# EAGLE design bioamplifier-00 (EAGLE 7.7.0)
CNAME: BIO-AMPLIFIER - BA01; CREVISION: B; DESIGNER: PEYRILLER
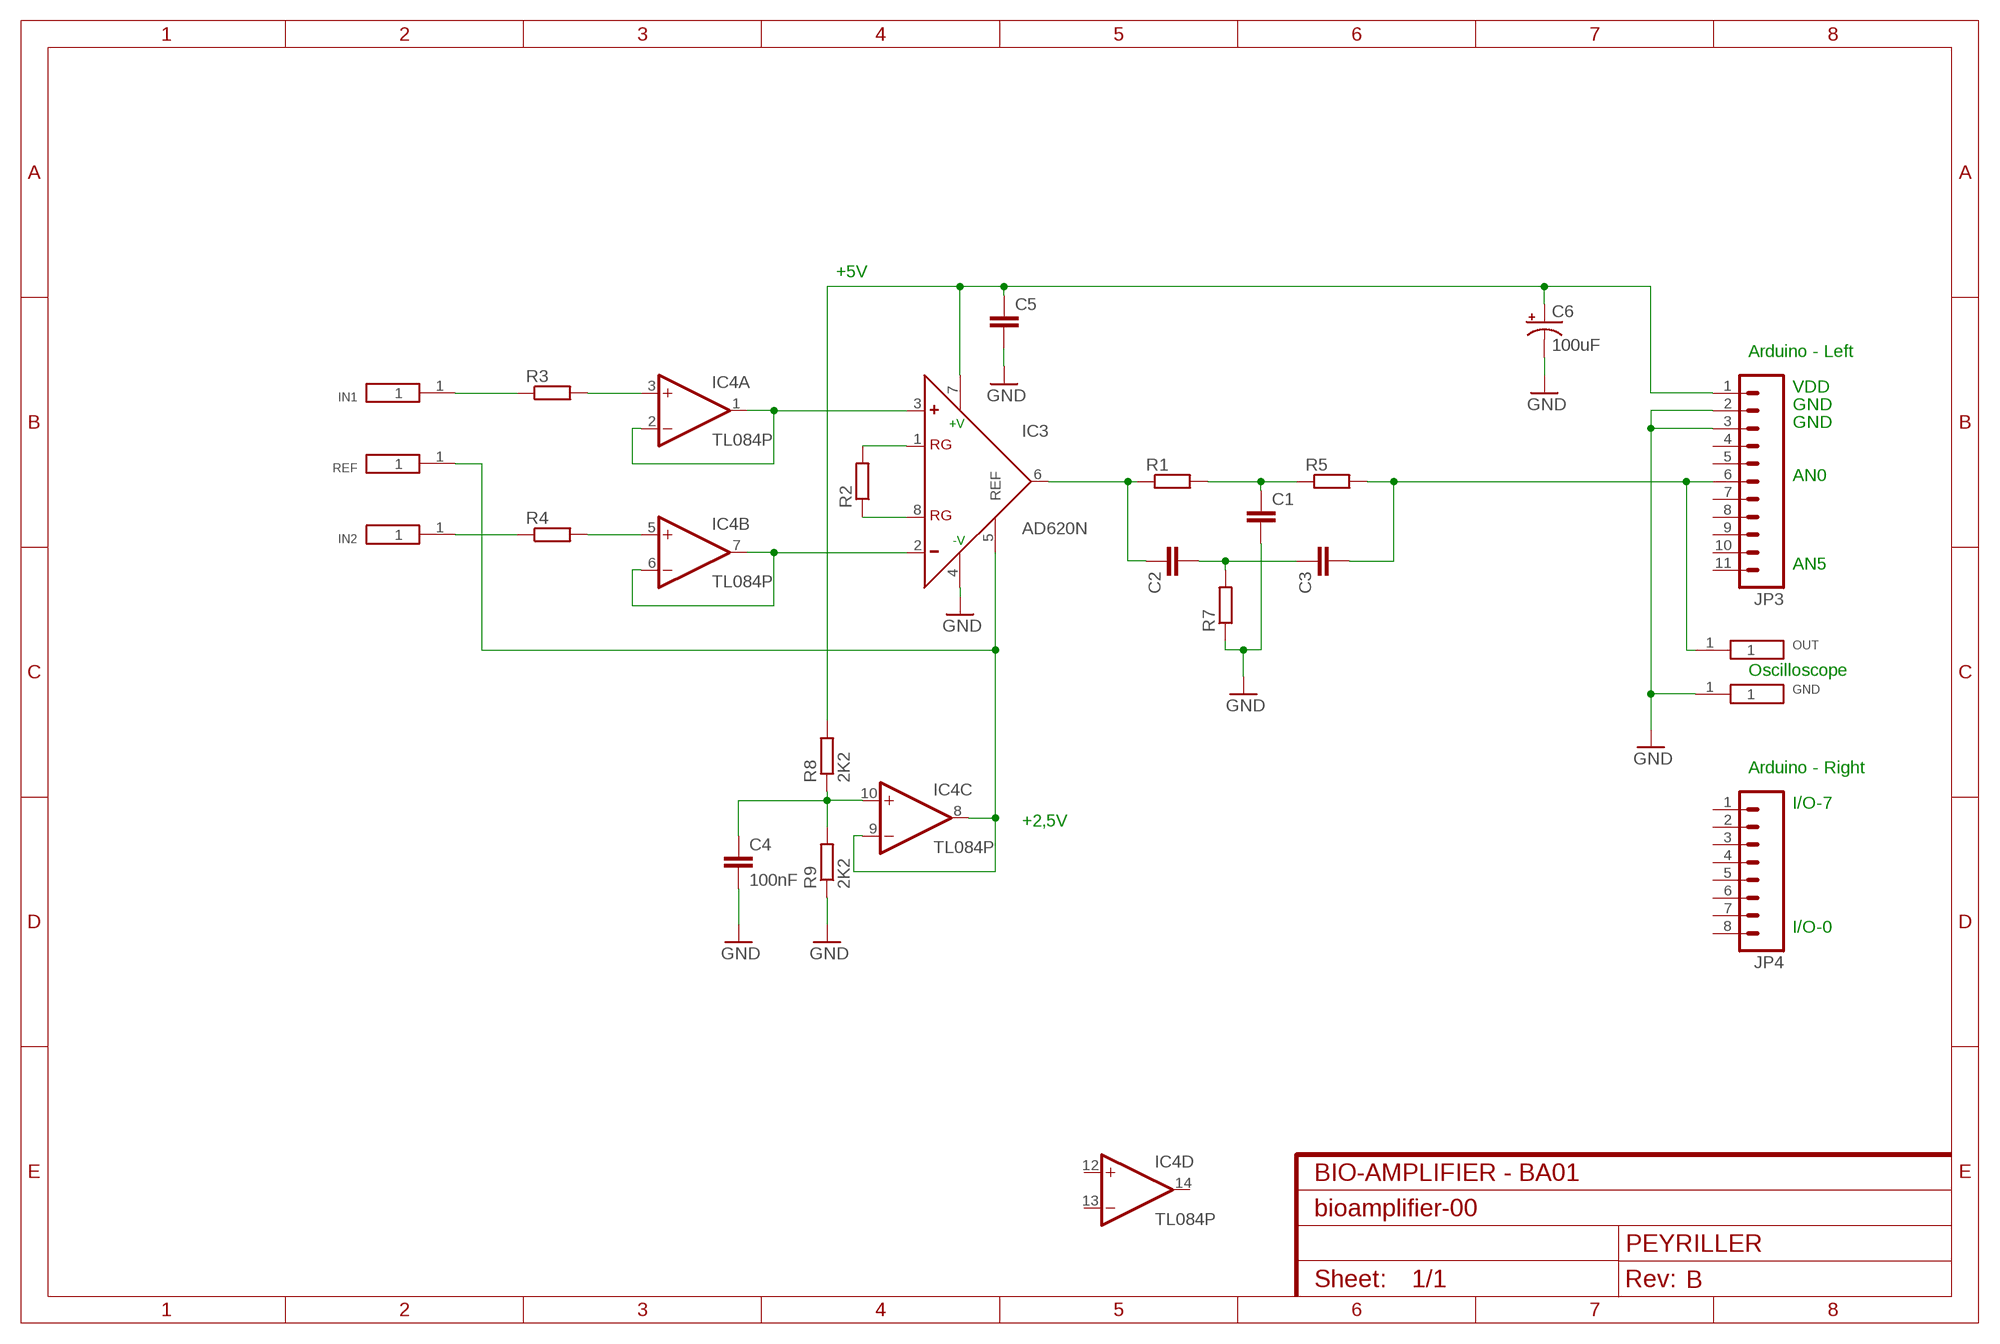
[diagram p0: schematic, sheet 1]

## Parts
C1  C5/3  [C5B3]
C2  C5/3  [C5B3]
C3  C5/3  [C5B3]
C4  100nF  C5/3  [C5B3]
C5  C5/3  [C5B3]
C6  100uF  100UF-10V-10%(TANT)  [EIA7343]
GND  PAD1  [PAD1]
IC3  AD620N  [DIL08]
IC4  TL084P  [DIL14]
IN1  PAD1  [PAD1]
IN2  PAD1  [PAD1]
JP3  M11LONGPADS  [1X11_LONGPADS]
JP4  M08LONGPADS  [1X08_LONGPADS]
OUT  PAD1  [PAD1]
R1  R-EU_0207/10  [0207/10]
R2  R-EU_0207/10  [0207/10]
R3  R-EU_0207/10  [0207/10]
R4  R-EU_0207/10  [0207/10]
R5  R-EU_0207/10  [0207/10]
R7  R-EU_0207/10  [0207/10]
R8  2K2  R-EU_0207/10  [0207/10]
R9  2K2  R-EU_0207/10  [0207/10]
REF  PAD1  [PAD1]

## Nets
GND: C1.2 C4.2 C5.2 C6.C(-) GND.1 IC3.4(-V) JP3.2 JP3.3 R7.1 R9.1
N$1: C2.1 IC3.6(OUT) R1.1
N$2: C1.1 R1.2 R5.1
N$3: C2.2 C3.1 R7.2
N$4: C3.2 JP3.6 OUT.1 R5.2
N$5: IC3.1(RG) R2.2
N$6: IC3.8(RG) R2.1
N$7: IC3.3(+) IC4.1(A:OUT) IC4.2(A:-IN)
N$8: IC3.2(-) IC4.6(B:-IN) IC4.7(B:OUT)
N$9: C5.1 C6.A(+) IC3.7(+V) JP3.1 R8.2
N$10: C4.1 IC4.10(C:+IN) R8.1 R9.2
N$12: IN1.1 R3.1
N$13: IC4.3(A:+IN) R3.2
N$14: IN2.1 R4.1
N$15: IC4.5(B:+IN) R4.2
N$16: IC3.5(REF) IC4.8(C:OUT) IC4.9(C:-IN) REF.1
Unconnected: IC4.12(D:+IN) IC4.13(D:-IN) IC4.14(D:OUT) JP3.4 JP3.5 JP3.7 JP3.8 JP3.9 JP3.10 JP3.11 JP4.1 JP4.2 JP4.3 JP4.4 JP4.5 JP4.6 JP4.7 JP4.8

## Notes on the sheet
- +5V
- Arduino - Left
- VDD
- GND
- GND
- AN0
- AN5
- Oscilloscope
- Arduino - Right
- I/O-7
- +2,5V
- I/O-0

## Power pins joined to a net without a drawn wire
V+: IC4.4(P:V+)
V-: IC4.11(P:V-)

## Library data of the parts
C1-C5 = capacitor-wima:C: CAPACITOR naming: grid - package width
C6 = SparkFun-Capacitors:100UF-10V-10%(TANT): CAP-07890; PROD_ID: CAP-07890
GND IN1 IN2 OUT REF = 0_JLE-2:PAD1: Single SMD Pad
IC3 = analog-devices:AD620: Low Cost, Low Power, Instrumentation Amplifier Source: http://www.analog.com/UploadedFiles/Data_Sheets/37793330023930AD620_e.pdf; MF: ALTERA CORPORATION; MPN: AD620AN; OC_FARNELL: 1523782; OC_NEWARK: 05F7108
IC4 = linear:TL084: OP AMP
JP3 = SparkFun-Connectors:M11: Header 11 Standard 11-pin 0.1" header. Use with straight break away headers (SKU : PRT-00116), right angle break away headers (PRT-00553), swiss pins (PRT-00743), machine pins (PRT-00117), and female headers (PRT-00115).
JP4 = SparkFun-Connectors:M08: Header 8 Standard 8-pin 0.1" header. Use with straight break away headers (SKU : PRT-00116), right angle break away headers (PRT-00553), swiss pins (PRT-00743), machine pins (PRT-00117), and female headers (PRT-00115).
R1-R5 R7-R9 = resistor:R-EU_: RESISTOR, European symbol

## Board
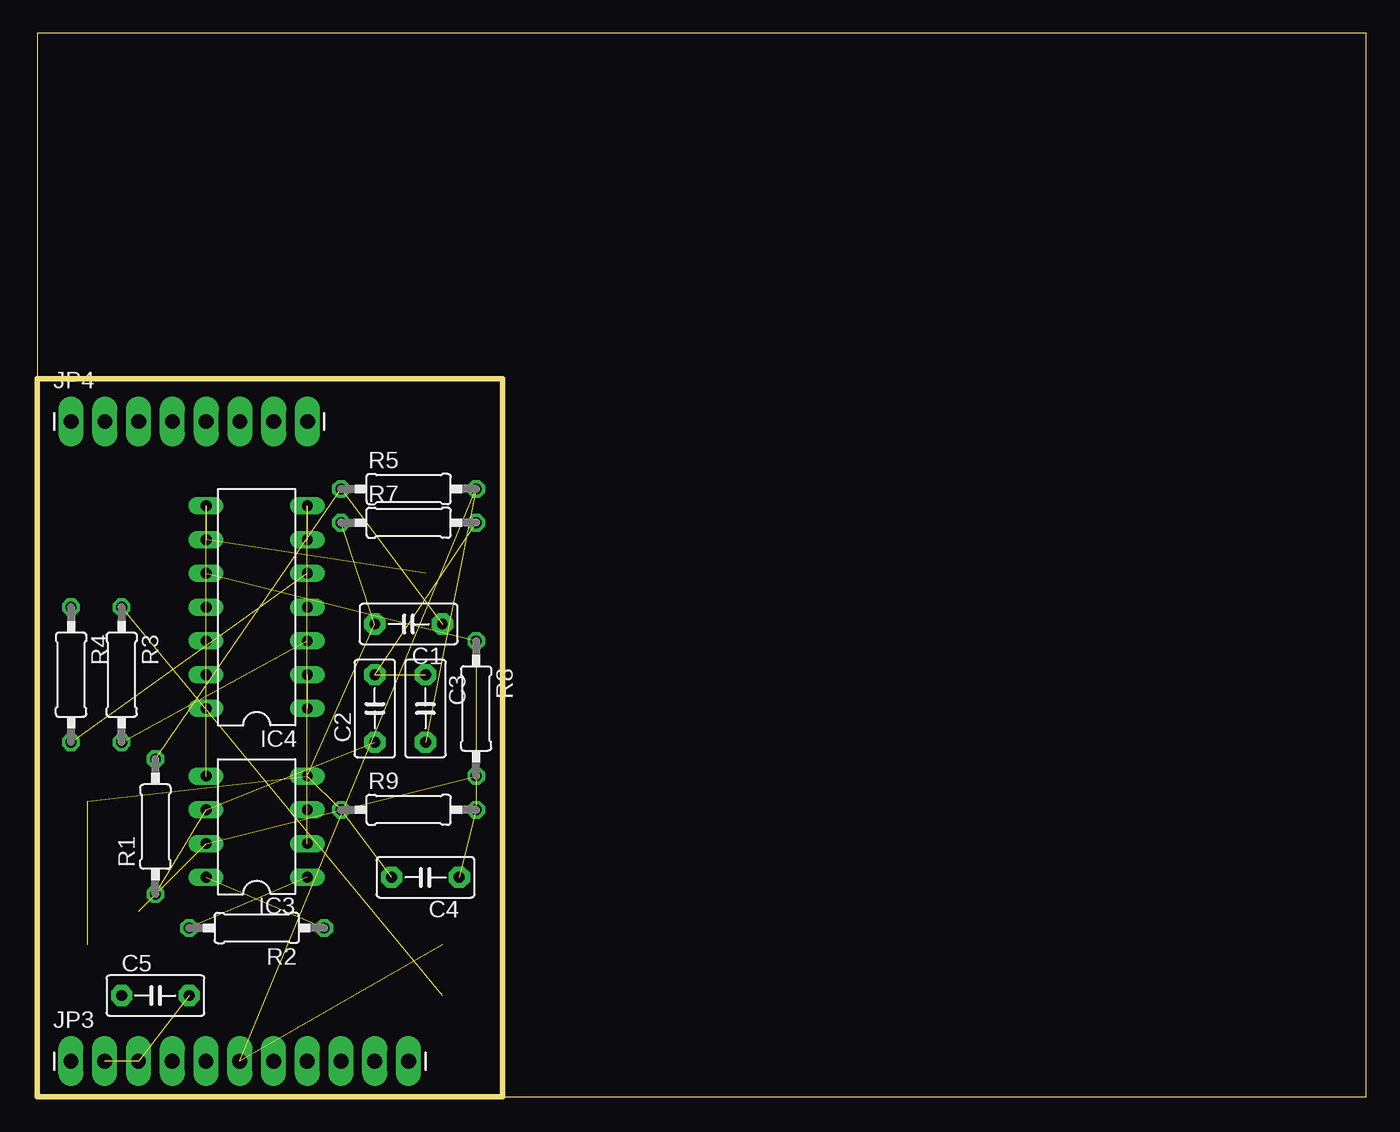
[diagram p1: board, top side]
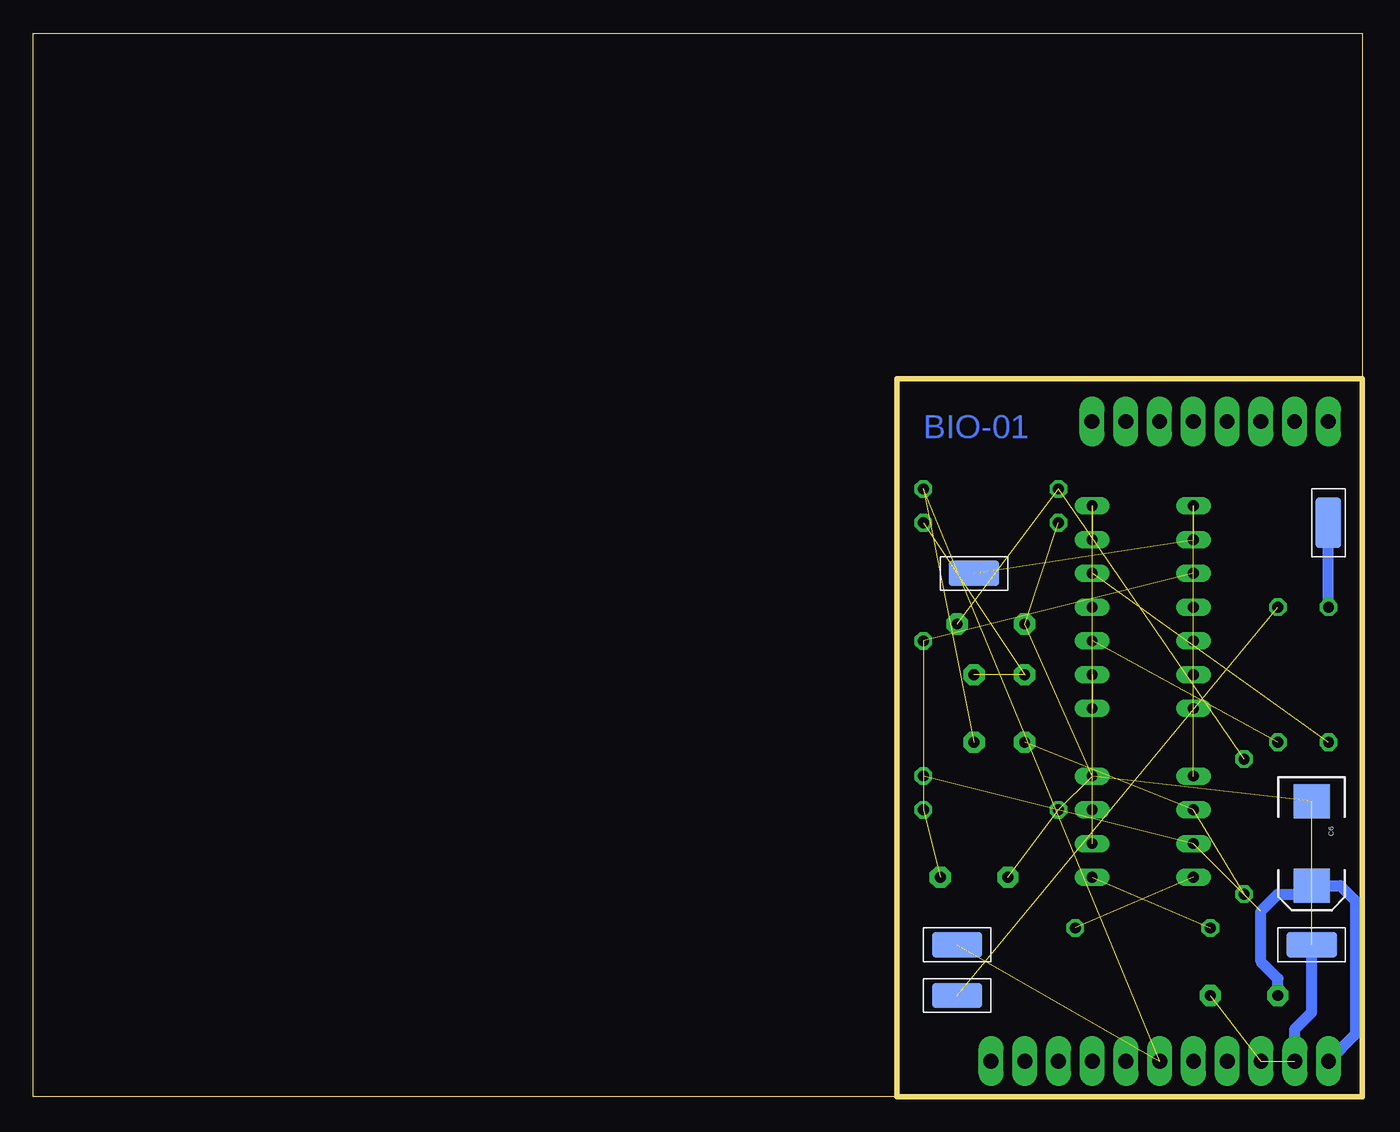
[diagram p2: board, bottom side, seen from below]

Size 100 x 80 mm. Coordinates in mm from the lower left corner, seen from the top.
Outline: 35,0 100,0 100,80 0,80 0,54
Outline: 0,54 0,0 35,0
Outline: 0,54 35,54 35,0
Copper layers (1*16): Top 0.035mm / dielectric 1.5mm / Bottom 0.035mm
Design rules "default": minimum track width 10mil, minimum drill 24mil, track to track 8mil, track to pad 8mil, pad to pad 8mil, via to via 8mil, smd to smd 8mil, copper to edge 40mil, drill to drill 8mil, minimum pad ring 10mil, minimum via ring 8mil, stop-mask expansion 4mil, vias tented up to drill 0mil, thermal gap 10mil

### Footprints (pad centres in the part's own frame; a part is rotated, then mirrored left to right if it is on the bottom)
C5B3 = drill 0.813 pad 1.6 octagon: 1 -2.54,0; 2 2.54,0
EIA7343 = smd 2.55 x 2.7: A 3.17,0; C -3.17,0
PAD1 = smd 1.93 x 3.81: 1 0,0
DIL08 = drill 0.813 long: 1 -3.81,-3.81; 2 -1.27,-3.81; 3 1.27,-3.81; 4 3.81,-3.81; 5 3.81,3.81; 6 1.27,3.81; 7 -1.27,3.81; 8 -3.81,3.81
DIL14 = drill 0.813 long: 1 -7.62,-3.81; 2 -5.08,-3.81; 3 -2.54,-3.81; 4 0,-3.81; 5 2.54,-3.81; 6 5.08,-3.81; 7 7.62,-3.81; 8 7.62,3.81; 9 5.08,3.81; 10 2.54,3.81; 11 0,3.81; 12 -2.54,3.81; 13 -5.08,3.81; 14 -7.62,3.81
1X11_LONGPADS = drill 1.118 pad 1.88 long: 1 0,0; 2 2.54,0; 3 5.08,0; 4 7.62,0; 5 10.16,0; 6 12.7,0; 7 15.24,0; 8 17.78,0; 9 20.32,0; 10 22.86,0; 11 25.4,0
1X08_LONGPADS = drill 1.118 pad 1.88 long: 1 0,0; 2 2.54,0; 3 5.08,0; 4 7.62,0; 5 10.16,0; 6 12.7,0; 7 15.24,0; 8 17.78,0
0207/10 = drill 0.813 octagon: 1 -5.08,0; 2 5.08,0

### Placement (x,y rotation side)
C1  27.94,35.56 180 top
C2  25.4,29.21 90 top
C3  29.21,29.21 270 top
C4  29.21,16.51 180 top
C5  8.89,7.62 0 top
C6  3.81,19.05 270 bottom
GND  3.81,11.43 90 bottom
IC3  16.51,20.32 90 top
IC4  16.51,36.83 90 top
IN1  30.48,7.62 90 bottom
IN2  2.54,43.18 0 bottom
JP3  2.53,2.69 0 top
JP4  2.55,50.8 0 top
OUT  30.48,11.43 90 bottom
R1  8.89,20.32 90 top
R2  16.51,12.7 180 top
R3  6.35,31.75 270 top
R4  2.54,31.75 270 top
R5  27.94,45.72 0 top
R7  27.94,43.18 0 top
R8  33.02,29.21 270 top
R9  27.94,21.59 0 top
REF  29.21,39.37 90 bottom

### Tracks (layer width: path | path; a pad name or v marks a point on that pad's centre or on a via)
GND  (8 unrouted)
  Bottom 0.813: JP3.2 5.07,5.07 5.08,5.08 3.81,6.35 GND.1
N$1  (2 unrouted)
N$2  (2 unrouted)
N$3  (2 unrouted)
N$4  (3 unrouted)
N$5  (1 unrouted)
N$6  (1 unrouted)
N$7  (2 unrouted)
N$8  (2 unrouted)
N$9  (2 unrouted)
  Bottom 0.813: C5.1 6.35,8.89 7.62,10.16 7.62,13.97 6.35,15.24 4.45,15.24 C6.A 1.66,15.88 0.51,14.73 0.51,4.71 JP3.1
N$10  (3 unrouted)
N$12  (1 unrouted)
N$13  (1 unrouted)
N$14
  Bottom 0.813: R4.1 IN2.1
N$15  (1 unrouted)
N$16  (3 unrouted)

### Text on the board
Bottom: BIO-01